# EAGLE design 3_buttons_a (EAGLE 6.4)
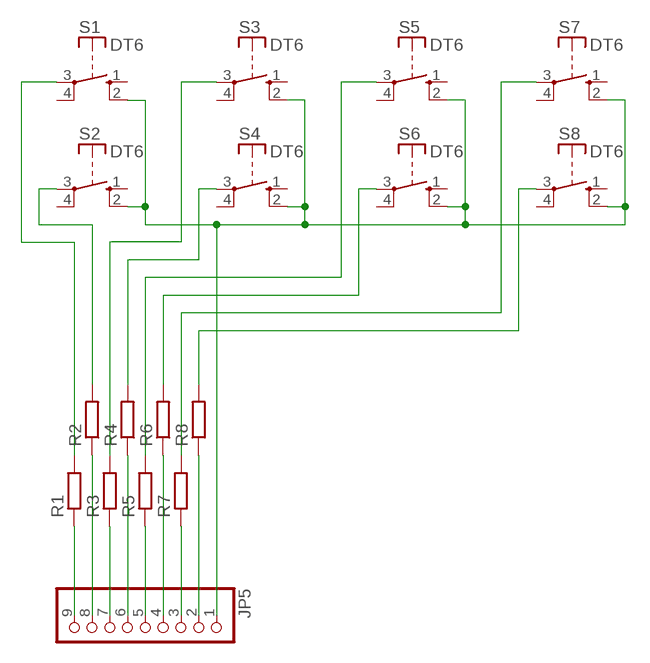
[diagram p0: schematic, sheet 1]

## Parts
JP5  PINHD-1X09_2.54-90°  [1X09/90]
R1  R_0207  [R_0207_BIGPADS]
R2  R_0207  [R_0207_BIGPADS]
R3  R_0207  [R_0207_BIGPADS]
R4  R_0207  [R_0207_BIGPADS]
R5  R_0207  [R_0207_BIGPADS]
R6  R_0207  [R_0207_BIGPADS]
R7  R_0207  [R_0207_BIGPADS]
R8  R_0207  [R_0207_BIGPADS]
S1  DT6  [DT6]
S2  DT6  [DT6]
S3  DT6  [DT6]
S4  DT6  [DT6]
S5  DT6  [DT6]
S6  DT6  [DT6]
S7  DT6  [DT6]
S8  DT6  [DT6]

## Nets
N$9: JP5.9 R1.P$1
N$10: JP5.8 R2.P$1
N$11: JP5.7 R3.P$1
N$12: JP5.6 R4.P$1
N$13: JP5.5 R5.P$1
N$14: JP5.4 R6.P$1
N$15: JP5.3 R7.P$1
N$16: JP5.2 R8.P$1
N$18: JP5.1 S1.2(S) S2.2(S) S3.2(S) S4.2(S) S5.2(S) S6.2(S) S7.2(S) S8.2(S)
N$19: R1.P$2 S1.3(P)
N$20: R2.P$2 S2.3(P)
N$21: R3.P$2 S3.3(P)
N$22: R4.P$2 S4.3(P)
N$23: R5.P$2 S5.3(P)
N$24: R6.P$2 S6.3(P)
N$25: R7.P$2 S7.3(P)
N$26: R8.P$2 S8.3(P)
Unconnected: S1.1(S) S1.4(P) S2.1(S) S2.4(P) S3.1(S) S3.4(P) S4.1(S) S4.4(P) S5.1(S) S5.4(P) S6.1(S) S6.4(P) S7.1(S) S7.4(P) S8.1(S) S8.4(P)

## Library data of the parts
JP5 = pinhead-2:PINHD-1X09: PIN HEADER
R1-R8 = _moja:R
S1-S8 = switch-misc:DT: ITT SWITCH

## Board
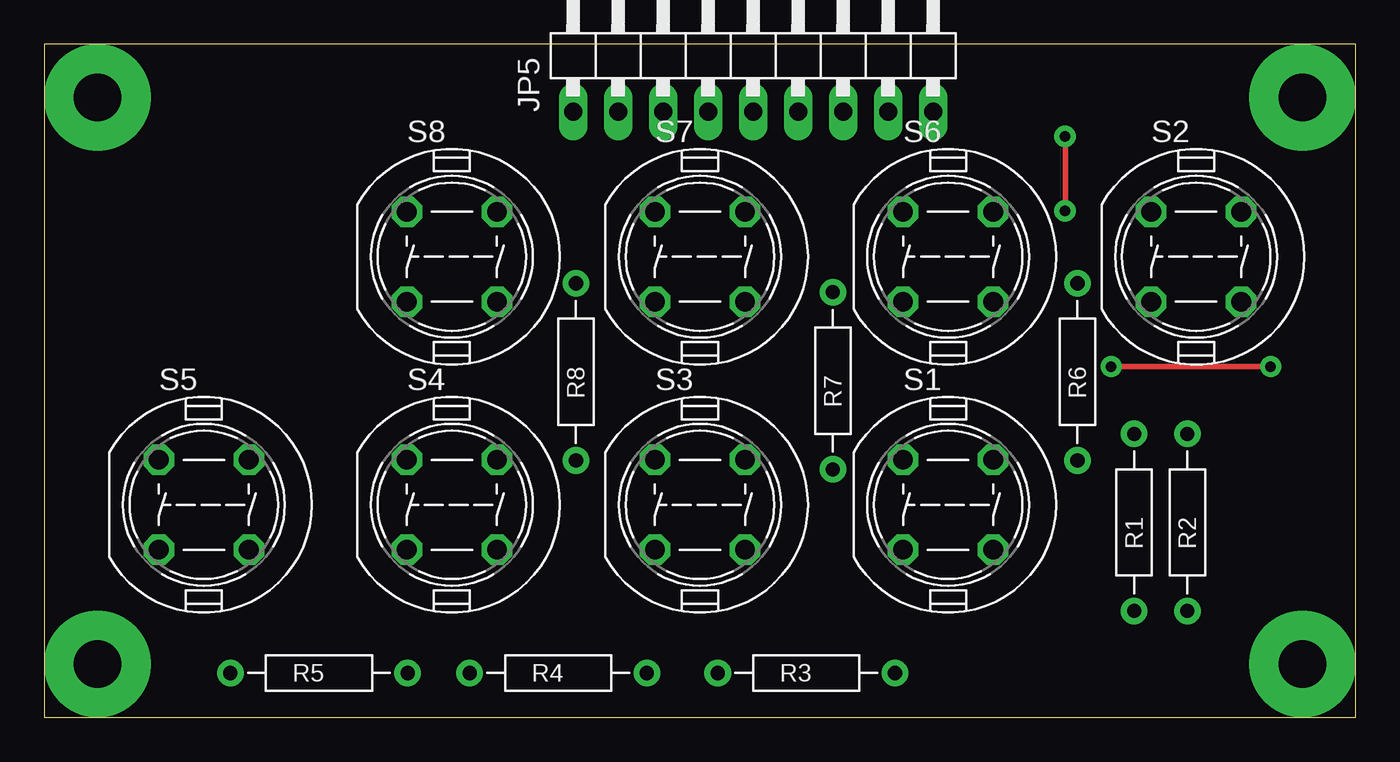
[diagram p1: board, top side]
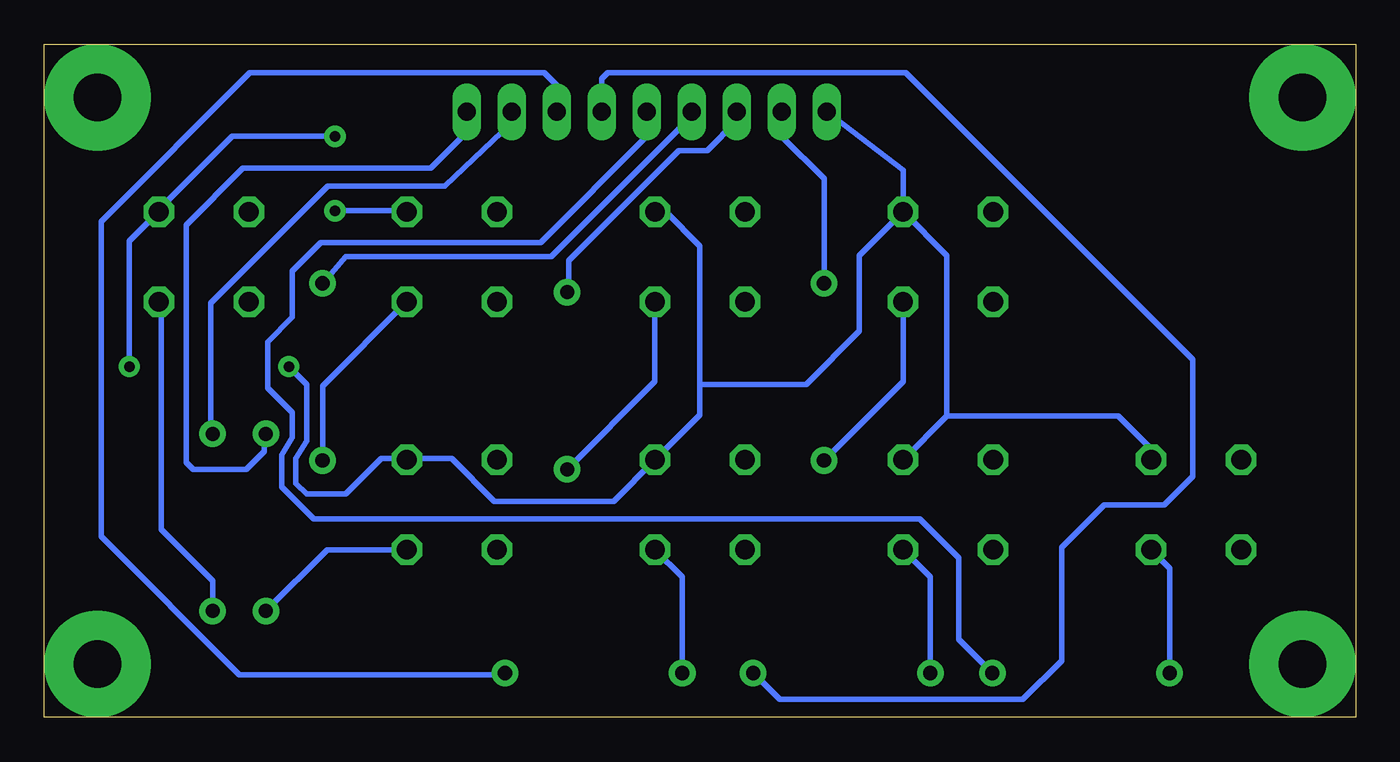
[diagram p2: board, bottom side, seen from below]

Size 74 x 38 mm. Coordinates in mm from the lower left corner, seen from the top.
Outline: 0,38 0,0 74,0 74,38 0,38
Copper layers (1*16): Top 0.035mm / dielectric 1.5mm / Bottom 0.035mm
Design rules "boris_freza": minimum track width 0.2mm, minimum drill 0.4mm, track to track 0.4mm, track to pad 0.4mm, pad to pad 0.4mm, via to via 0.4mm, smd to smd 0.25mm, copper to edge 10mil, drill to drill 8mil, minimum pad ring 0.3mm, minimum via ring 0.3mm, stop-mask expansion 4mil, vias tented up to drill 0mil, thermal gap 10mil

### Footprints (pad centres in the part's own frame; a part is rotated, then mirrored left to right if it is on the bottom)
1X09/90 = drill 1.016 long: 1 -10.16,-3.81; 2 -7.62,-3.81; 3 -5.08,-3.81; 4 -2.54,-3.81; 5 0,-3.81; 6 2.54,-3.81; 7 5.08,-3.81; 8 7.62,-3.81; 9 10.16,-3.81
R_0207_BIGPADS = drill 0.8 pad 1.5: P$1 5,0; P$2 -5,0
DT6 = drill 1.118 octagon: 1 -2.54,2.54; 2 2.54,2.54; 3 2.54,-2.54; 4 -2.54,-2.54

### Placement (x,y rotation side)
JP5  40,38 0 top
R1  61.5,11 90 top
R2  64.5,11 90 top
R3  43,2.5 0 top
R4  29,2.5 0 top
R5  15.5,2.5 0 top
R6  58.3,19.5 90 top
R7  44.5,19 90 top
R8  30,19.5 90 top
S1  51,12 0 top
S2  65,26 0 top
S3  37,12 0 top
S4  23,12 0 top
S5  9,12 0 top
S6  51,26 0 top
S7  37,26 0 top
S8  23,26 0 top

### Tracks (layer width: path | path; a pad name or v marks a point on that pad's centre or on a via)
N$5  (via drill 2.7 pad 6)
  other vias: 3,3
N$6  (via drill 2.7 pad 6)
  other vias: 71,3
N$7  (via drill 2.7 pad 6)
  other vias: 3,35
N$8  (via drill 2.7 pad 6)
  other vias: 71,35
N$9
  Bottom 0.3: JP5.9 50.16,33.04 52.2,31 62.8,31 66,27.8 66,14.4 65.6,14 62.6,14 61.6,15 61.6,15.9 R1.P$1
N$10
  Bottom 0.3: JP5.8 47.62,33.58 51.4,30 58,30 64.6,23.4 64.6,16.1 R2.P$1
N$11
  Bottom 0.3: JP5.7 45.08,35.68 45.8,36.4 62.4,36.4 70.8,28 70.8,10.2 63,2.4 48.1,2.4 R3.P$1
N$12
  Bottom 0.3: JP5.6 42.54,36.06 42.2,36.4 25.4,36.4 9.2,20.2 9.2,13.6 10.8,12 14.2,12 16.6,9.6 16.6,3.2 18.8,1 32.5,1 R4.P$1
N$13
  Bottom 0.3: JP5.5 40,32.8 46,26.8 58.4,26.8 60,25.2 60,22.6 61.4,21.2 61.4,18.6 60,17.2 60,15.8 60.6,14.8 60.6,13 58.8,11.2 24.6,11.2 22.4,9 22.4,4.4 R5.P$1
N$14
  Bottom 0.3: JP5.4 37.46,33.94 45.4,26 57,26 R6.P$1
N$15
  Bottom 0.3: JP5.3 34.92,33.68 36.6,32 38.2,32 44.4,25.8 44.4,24.1 R7.P$1
N$16
  Bottom 0.3: JP5.2 32.38,32.78 30,30.4 R8.P$1
N$18  (via drill 0.6)
  Top 0.3: v57.6,32.8 v57.6,28.6 | v60.2,19.8 v69.2,19.8
  Bottom 0.3: S8.2 25.54,30.89 JP5.1 | S7.2 38.94,28.54 37,26.6 37,18.8 | 37,18.8 37,17.08 S3.2 41.88,12.2 48.6,12.2 51,14.6 53.48,14.6 S1.2 53.6,14.6 55,14.6 57,12.6 59.2,12.6 59.8,13.2 59.8,14.6 59.2,15.6 59.2,18.8 v60.2,19.8 | S5.2 11.54,15.14 13.4,17 23.08,17 | 23.08,17 S4.2 25.74,14.26 | v57.6,32.8 63.4,32.8 67.54,28.66 S2.2 69.2,26.88 v69.2,19.8 | v57.6,28.6 53.6,28.6 S6.2 | S8.2 28,26.08 28,21.8 31,18.8 37,18.8 | 23.08,17 23.08,26.08 S8.2
N$19
  Bottom 0.3: S1.3 58.04,9.46 R1.P$2
N$20
  Bottom 0.3: R2.P$2 64.5,7.7 67.4,10.6 67.4,23.32 S2.3
N$21
  Bottom 0.3: R3.P$2 38,7.92 S3.3
N$22
  Bottom 0.3: R4.P$2 24,7.92 S4.3
N$23
  Bottom 0.3: R5.P$2 10.5,8.42 S5.3
N$24
  Bottom 0.3: R6.P$2 58.3,18.7 S6.3
N$25
  Bottom 0.3: S7.3 39.54,18.96 R7.P$2
N$26
  Bottom 0.3: S8.3 25.54,18.96 R8.P$2